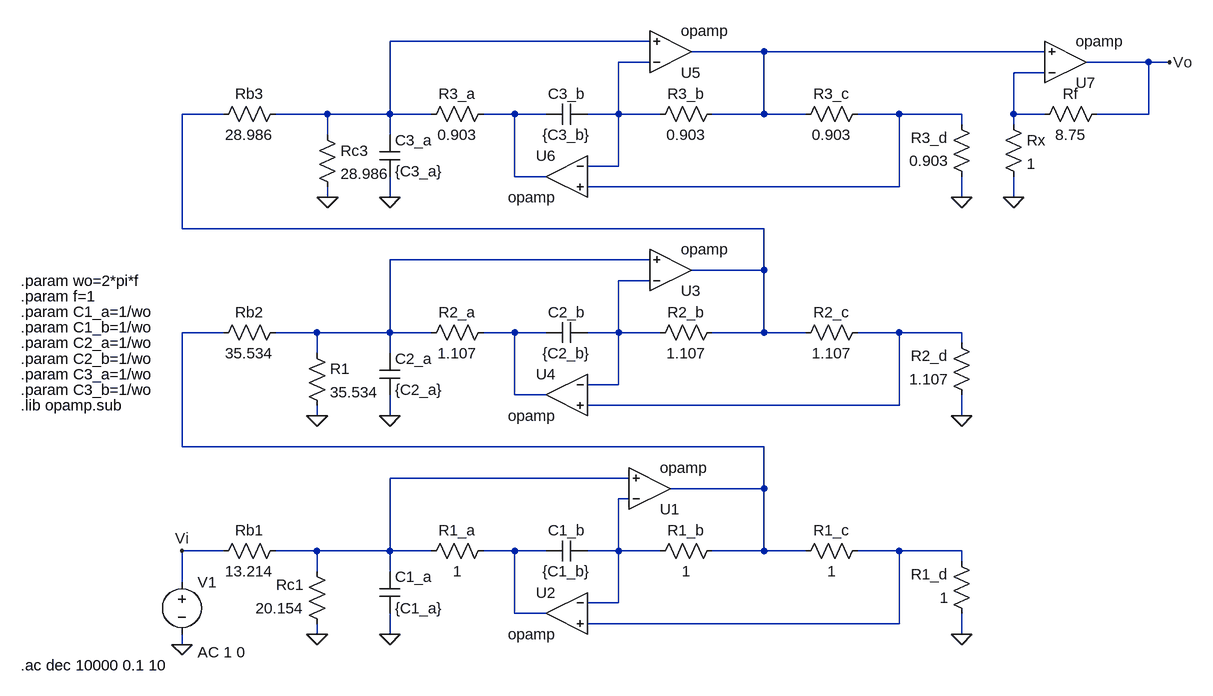
[diagram p0: schematic GIC_BIC.asc]
GIC_BIC.asc, the LTspice schematic file:
Version 4
SHEET 1 1184 680
WIRE 336 -544 -64 -544
WIRE 512 -528 400 -528
WIRE 944 -528 512 -528
WIRE 336 -512 288 -512
WIRE 1104 -512 1008 -512
WIRE 1136 -512 1104 -512
WIRE 944 -496 896 -496
WIRE -320 -432 -384 -432
WIRE -160 -432 -240 -432
WIRE -64 -432 -64 -544
WIRE -64 -432 -160 -432
WIRE 0 -432 -64 -432
WIRE 128 -432 80 -432
WIRE 176 -432 128 -432
WIRE 288 -432 288 -512
WIRE 288 -432 240 -432
WIRE 352 -432 288 -432
WIRE 512 -432 512 -528
WIRE 512 -432 432 -432
WIRE 576 -432 512 -432
WIRE 720 -432 656 -432
WIRE 816 -432 720 -432
WIRE 896 -432 896 -496
WIRE 944 -432 896 -432
WIRE 1104 -432 1104 -512
WIRE 1104 -432 1024 -432
WIRE 816 -416 816 -432
WIRE 896 -416 896 -432
WIRE -160 -400 -160 -432
WIRE -64 -400 -64 -432
WIRE 288 -352 288 -432
WIRE 288 -352 240 -352
WIRE 128 -336 128 -432
WIRE 176 -336 128 -336
WIRE 720 -320 720 -432
WIRE 720 -320 240 -320
WIRE -160 -304 -160 -320
WIRE -64 -304 -64 -336
WIRE 816 -304 816 -336
WIRE 896 -304 896 -336
WIRE -384 -256 -384 -432
WIRE 512 -256 -384 -256
WIRE 336 -208 -64 -208
WIRE 512 -192 512 -256
WIRE 512 -192 400 -192
WIRE 336 -176 288 -176
WIRE -320 -96 -384 -96
WIRE -176 -96 -240 -96
WIRE -64 -96 -64 -208
WIRE -64 -96 -176 -96
WIRE 0 -96 -64 -96
WIRE 128 -96 80 -96
WIRE 176 -96 128 -96
WIRE 288 -96 288 -176
WIRE 288 -96 240 -96
WIRE 352 -96 288 -96
WIRE 512 -96 512 -192
WIRE 512 -96 432 -96
WIRE 576 -96 512 -96
WIRE 720 -96 656 -96
WIRE 816 -96 720 -96
WIRE 816 -80 816 -96
WIRE -176 -64 -176 -96
WIRE -64 -64 -64 -96
WIRE 288 -16 288 -96
WIRE 288 -16 240 -16
WIRE 128 0 128 -96
WIRE 176 0 128 0
WIRE 720 16 720 -96
WIRE 720 16 240 16
WIRE -176 32 -176 16
WIRE -64 32 -64 0
WIRE 816 32 816 0
WIRE -384 80 -384 -96
WIRE 512 80 -384 80
WIRE 304 128 -64 128
WIRE 512 144 512 80
WIRE 512 144 368 144
WIRE 304 160 288 160
WIRE -320 240 -384 240
WIRE -176 240 -240 240
WIRE -64 240 -64 128
WIRE -64 240 -176 240
WIRE 0 240 -64 240
WIRE 128 240 80 240
WIRE 176 240 128 240
WIRE 288 240 288 160
WIRE 288 240 240 240
WIRE 352 240 288 240
WIRE 512 240 512 144
WIRE 512 240 432 240
WIRE 576 240 512 240
WIRE 720 240 656 240
WIRE 816 240 720 240
WIRE 816 256 816 240
WIRE -176 272 -176 240
WIRE -64 272 -64 240
WIRE -384 288 -384 240
WIRE 288 320 288 240
WIRE 288 320 240 320
WIRE 128 336 128 240
WIRE 176 336 128 336
WIRE 720 352 720 240
WIRE 720 352 240 352
WIRE -176 368 -176 352
WIRE -64 368 -64 336
WIRE 816 368 816 336
WIRE -384 384 -384 368
FLAG -64 368 0
FLAG -176 368 0
FLAG 816 368 0
FLAG -384 384 0
FLAG -64 32 0
FLAG 816 32 0
FLAG -64 -304 0
FLAG 816 -304 0
FLAG 896 -304 0
FLAG 1136 -512 Vo
FLAG -384 240 Vi
FLAG -160 -304 0
FLAG -176 32 0
SYMBOL OpAmps\\opamp 336 208 M180
SYMATTR InstName U1
SYMBOL OpAmps\\opamp 208 272 M0
SYMATTR InstName U2
SYMBOL res 96 224 R90
WINDOW 0 0 56 VBottom 2
WINDOW 3 32 56 VTop 2
SYMATTR InstName R1_a
SYMATTR Value 1
SYMBOL res 448 224 R90
WINDOW 0 0 56 VBottom 2
WINDOW 3 32 56 VTop 2
SYMATTR InstName R1_b
SYMATTR Value 1
SYMBOL res 672 224 R90
WINDOW 0 0 56 VBottom 2
WINDOW 3 32 56 VTop 2
SYMATTR InstName R1_c
SYMATTR Value 1
SYMBOL res 832 352 R180
WINDOW 0 36 76 Left 2
WINDOW 3 36 40 Left 2
SYMATTR InstName R1_d
SYMATTR Value 1
SYMBOL res -160 368 R180
WINDOW 0 36 76 Left 2
WINDOW 3 36 40 Left 2
SYMATTR InstName Rc1
SYMATTR Value 20.154
SYMBOL res -336 256 R270
WINDOW 0 32 56 VTop 2
WINDOW 3 0 56 VBottom 2
SYMATTR InstName Rb1
SYMATTR Value 13.214
SYMBOL cap -80 272 R0
SYMATTR InstName C1_a
SYMATTR Value {C1_a}
SYMBOL cap 240 224 R90
WINDOW 0 0 32 VBottom 2
WINDOW 3 32 32 VTop 2
SYMATTR InstName C1_b
SYMATTR Value {C1_b}
SYMBOL voltage -384 272 R0
WINDOW 123 24 124 Left 2
WINDOW 39 0 0 Left 0
SYMATTR Value2 AC 1 0
SYMATTR InstName V1
SYMATTR Value ""
SYMBOL OpAmps\\opamp 368 -128 M180
SYMATTR InstName U3
SYMBOL OpAmps\\opamp 208 -64 M0
SYMATTR InstName U4
SYMBOL res 96 -112 R90
WINDOW 0 0 56 VBottom 2
WINDOW 3 32 56 VTop 2
SYMATTR InstName R2_a
SYMATTR Value 1.107
SYMBOL res 448 -112 R90
WINDOW 0 0 56 VBottom 2
WINDOW 3 32 56 VTop 2
SYMATTR InstName R2_b
SYMATTR Value 1.107
SYMBOL res 672 -112 R90
WINDOW 0 0 56 VBottom 2
WINDOW 3 32 56 VTop 2
SYMATTR InstName R2_c
SYMATTR Value 1.107
SYMBOL res 832 16 R180
WINDOW 0 36 76 Left 2
WINDOW 3 36 40 Left 2
SYMATTR InstName R2_d
SYMATTR Value 1.107
SYMBOL res -336 -80 R270
WINDOW 0 32 56 VTop 2
WINDOW 3 0 56 VBottom 2
SYMATTR InstName Rb2
SYMATTR Value 35.534
SYMBOL cap -80 -64 R0
SYMATTR InstName C2_a
SYMATTR Value {C2_a}
SYMBOL cap 240 -112 R90
WINDOW 0 0 32 VBottom 2
WINDOW 3 32 32 VTop 2
SYMATTR InstName C2_b
SYMATTR Value {C2_b}
SYMBOL OpAmps\\opamp 368 -464 M180
SYMATTR InstName U5
SYMBOL OpAmps\\opamp 208 -400 M0
SYMATTR InstName U6
SYMBOL res 96 -448 R90
WINDOW 0 0 56 VBottom 2
WINDOW 3 32 56 VTop 2
SYMATTR InstName R3_a
SYMATTR Value 0.903
SYMBOL res 448 -448 R90
WINDOW 0 0 56 VBottom 2
WINDOW 3 32 56 VTop 2
SYMATTR InstName R3_b
SYMATTR Value 0.903
SYMBOL res 672 -448 R90
WINDOW 0 0 56 VBottom 2
WINDOW 3 32 56 VTop 2
SYMATTR InstName R3_c
SYMATTR Value 0.903
SYMBOL res 832 -320 R180
WINDOW 0 36 76 Left 2
WINDOW 3 36 40 Left 2
SYMATTR InstName R3_d
SYMATTR Value 0.903
SYMBOL res -336 -416 R270
WINDOW 0 32 56 VTop 2
WINDOW 3 0 56 VBottom 2
SYMATTR InstName Rb3
SYMATTR Value 28.986
SYMBOL cap -80 -400 R0
SYMATTR InstName C3_a
SYMATTR Value {C3_a}
SYMBOL cap 240 -448 R90
WINDOW 0 0 32 VBottom 2
WINDOW 3 32 32 VTop 2
SYMATTR InstName C3_b
SYMATTR Value {C3_b}
SYMBOL OpAmps\\opamp 976 -448 M180
SYMATTR InstName U7
SYMBOL res 880 -432 R0
SYMATTR InstName Rx
SYMATTR Value 1
SYMBOL res 1040 -448 R90
WINDOW 0 0 56 VBottom 2
WINDOW 3 32 56 VTop 2
SYMATTR InstName Rf
SYMATTR Value 8.75
SYMBOL res -176 -416 R0
SYMATTR InstName Rc3
SYMATTR Value 28.986
SYMBOL res -192 -80 R0
SYMATTR InstName R1
SYMATTR Value 35.534
TEXT -632 16 Left 2 !.lib opamp.sub
TEXT -632 -176 Left 2 !.param wo=2*pi*f
TEXT -632 -152 Left 2 !.param f=1
TEXT -632 -128 Left 2 !.param C1_a=1/wo
TEXT -632 -104 Left 2 !.param C1_b=1/wo
TEXT -632 -80 Left 2 !.param C2_a=1/wo
TEXT -632 -56 Left 2 !.param C2_b=1/wo
TEXT -632 -32 Left 2 !.param C3_a=1/wo
TEXT -632 -8 Left 2 !.param C3_b=1/wo
TEXT -632 416 Left 2 !.ac dec 10000 0.1 10

The netlist it stands for:
* GIC_BIC.asc
XU1 N014 N013 N010 opamp Aol=100K GBW=10Meg  ; pins invin noninvin out
XU2 N014 N016 N015 opamp Aol=100K GBW=10Meg  ; pins invin noninvin out
R1_a N015 N013 1
R1_b N010 N014 1
R1_c N016 N010 1
R1_d 0 N016 1
Rc1 0 N013 20.154
Rb1 Vi N013 13.214
C1_a N013 0 {C1_a}
C1_b N014 N015 {C1_b}
V1 Vi 0 AC 1 0
XU3 N009 N008 N005 opamp Aol=100K GBW=10Meg  ; pins invin noninvin out
XU4 N009 N012 N011 opamp Aol=100K GBW=10Meg  ; pins invin noninvin out
R2_a N011 N008 1.107
R2_b N005 N009 1.107
R2_c N012 N005 1.107
R2_d 0 N012 1.107
Rb2 N010 N008 35.534
C2_a N008 0 {C2_a}
C2_b N009 N011 {C2_b}
XU5 N003 N001 N002 opamp Aol=100K GBW=10Meg  ; pins invin noninvin out
XU6 N003 N007 N006 opamp Aol=100K GBW=10Meg  ; pins invin noninvin out
R3_a N006 N001 0.903
R3_b N002 N003 0.903
R3_c N007 N002 0.903
R3_d 0 N007 0.903
Rb3 N005 N001 28.986
C3_a N001 0 {C3_a}
C3_b N003 N006 {C3_b}
XU7 N004 N002 Vo opamp Aol=100K GBW=10Meg  ; pins invin noninvin out
Rx N004 0 1
Rf Vo N004 8.75
Rc3 N001 0 28.986
R1 N008 0 35.534
.lib opamp.sub
.param wo=2*pi*f
.param f=1
.param C1_a=1/wo
.param C1_b=1/wo
.param C2_a=1/wo
.param C2_b=1/wo
.param C3_a=1/wo
.param C3_b=1/wo
.ac dec 10000 0.1 10
.backanno
.end